# EasyEDA schematic SCH_New-Project_2025-06-10 (1).json
TITLE: Sheet_1; REV: 1.0; Date: 2025-06-10; Sheet: 1/1; Drawn By: vicmfvs; Company: Your Company
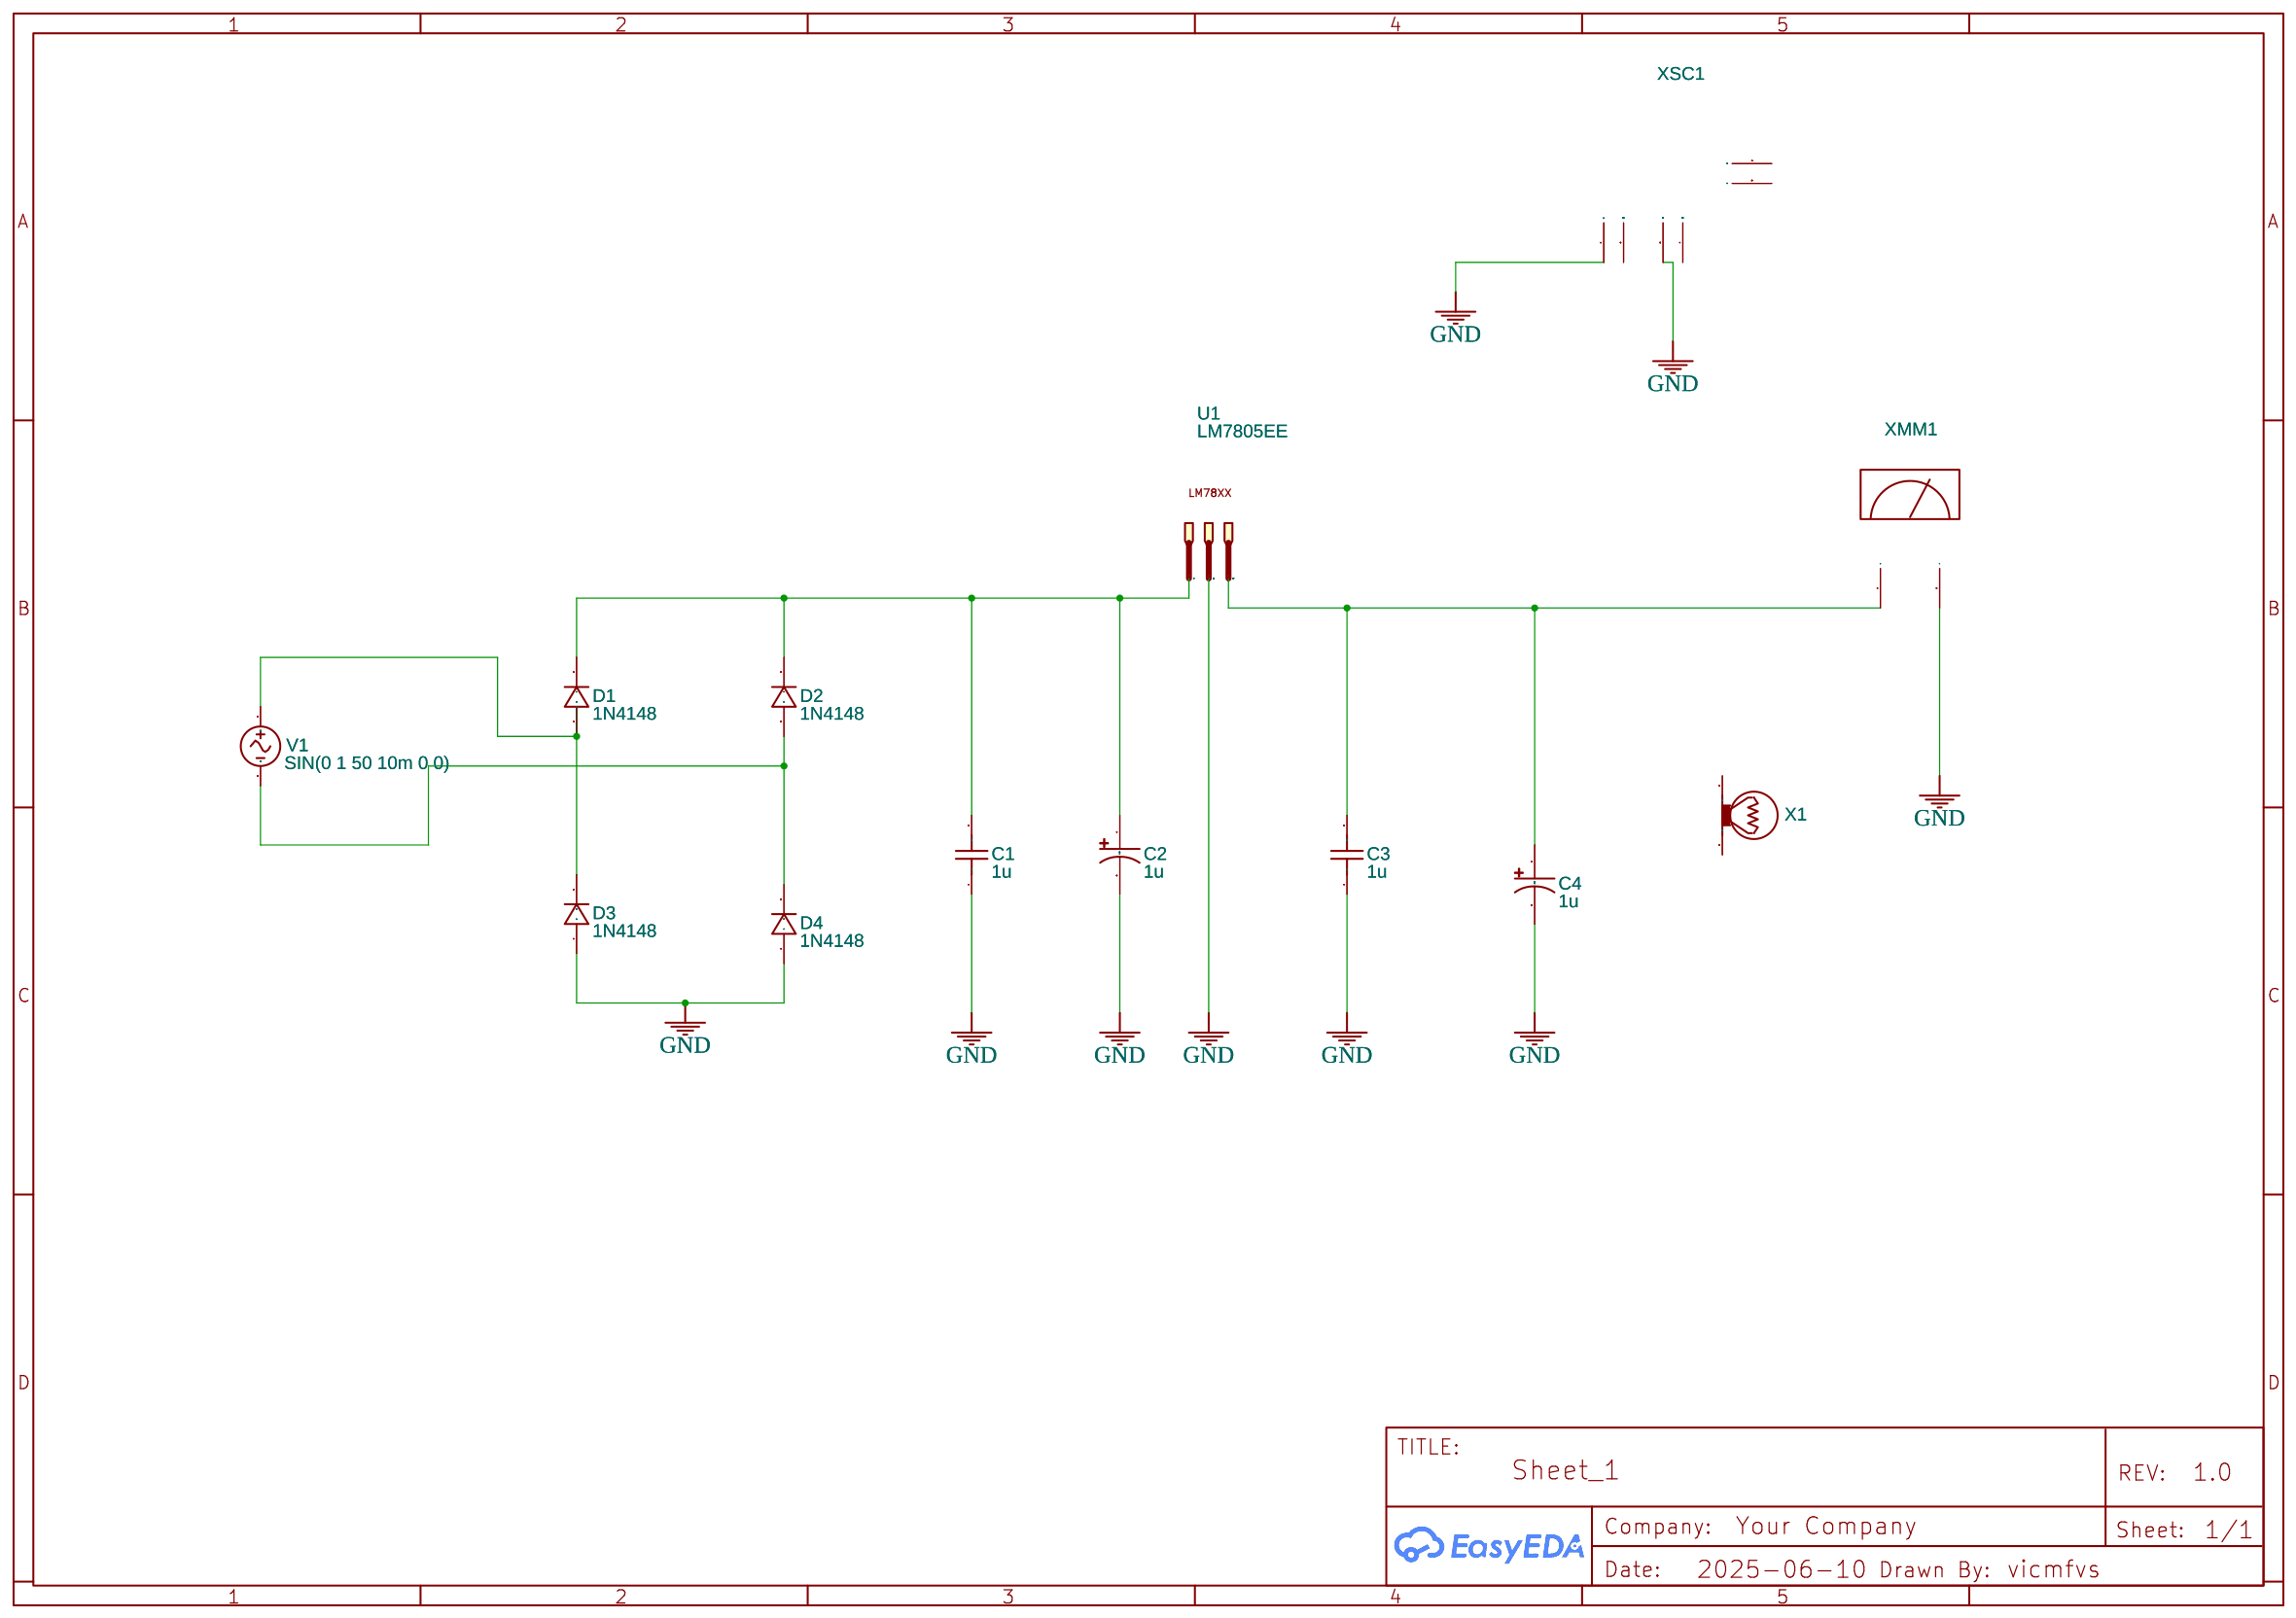
[diagram p0: schematic sheet]

## Parts
C1  1u  [RAD-0.1]
C2  1u  [CAP-D3.0XF1.5]
C3  1u  [RAD-0.1]
C4  1u  [CAP-D3.0XF1.5]
D1  1N4148  [DO-35]
D2  1N4148  [DO-35]
D3  1N4148  [DO-35]
D4  1N4148  [DO-35]
U1  LM7805EE
V1  SIN(0 1 50 10m 0 0)  [HDR1X2]
X1  Lamp
XMM1  Multimeter
XSC1  Oscilloscope

## Library data of the parts
C1 C3 = Capacitor_US: Contributor: EasyEDA; Supplier: YUJING
C2 C4 = Capacitor_Electrolytic_US: Supplier: YUJING; Contributor: EasyEDA
D1-D4 = 1N4148: Contributor: EasyEDA
U1 = 78XX: catid: 20; Contributor: EasyEDA
V1 = VSin: Contributor: EasyEDA; sim: true
X1 = LAMP: catid: 20; Dropout Voltage: 12; Power: 10; Contributor: EasyEDA; NameDisplay: 0
XMM1 = MULTIMETER: Supplier: LCSC; Multimeter Type: Voltmeter; Power Type: AC; Voltmeter resistance: 10μ; Ammeter resistance: 1G; NameDisplay: 0; Contributor: EasyEDA; sim: true
XSC1 = OSCILLOSCOPE: Contributor: EasyEDA; NameDisplay: 0; sim: true

## Nets
GND: C1.1 C2.2 C3.1 C4.2 D3.1(A) D4.1(A) U1.2(GND) XMM1.2(I) XSC1.1(A) XSC1.3(B)
Net-(C1-2): C1.2 C2.1 D1.2(K) D2.2(K) U1.1(IN)
Net-(C3-2): C3.2 C4.1 U1.3(OUT) XMM1.1(+)
Net-(D1-1): D1.1(A) D3.2(K) V1.1
Net-(D2-1): D2.1(A) D4.2(K) V1.2

Not connected (* = marked no-connect by the designer): X1 1 2; XSC1 2(GND1) 4(GND2) 5(T+) 6(T-)
